# Altium schematic sheet BAT_Simulator.SchDoc
size A4; Organization: PERT; SheetNumber: 1; SheetTotal: 1; Sub Team: EEE
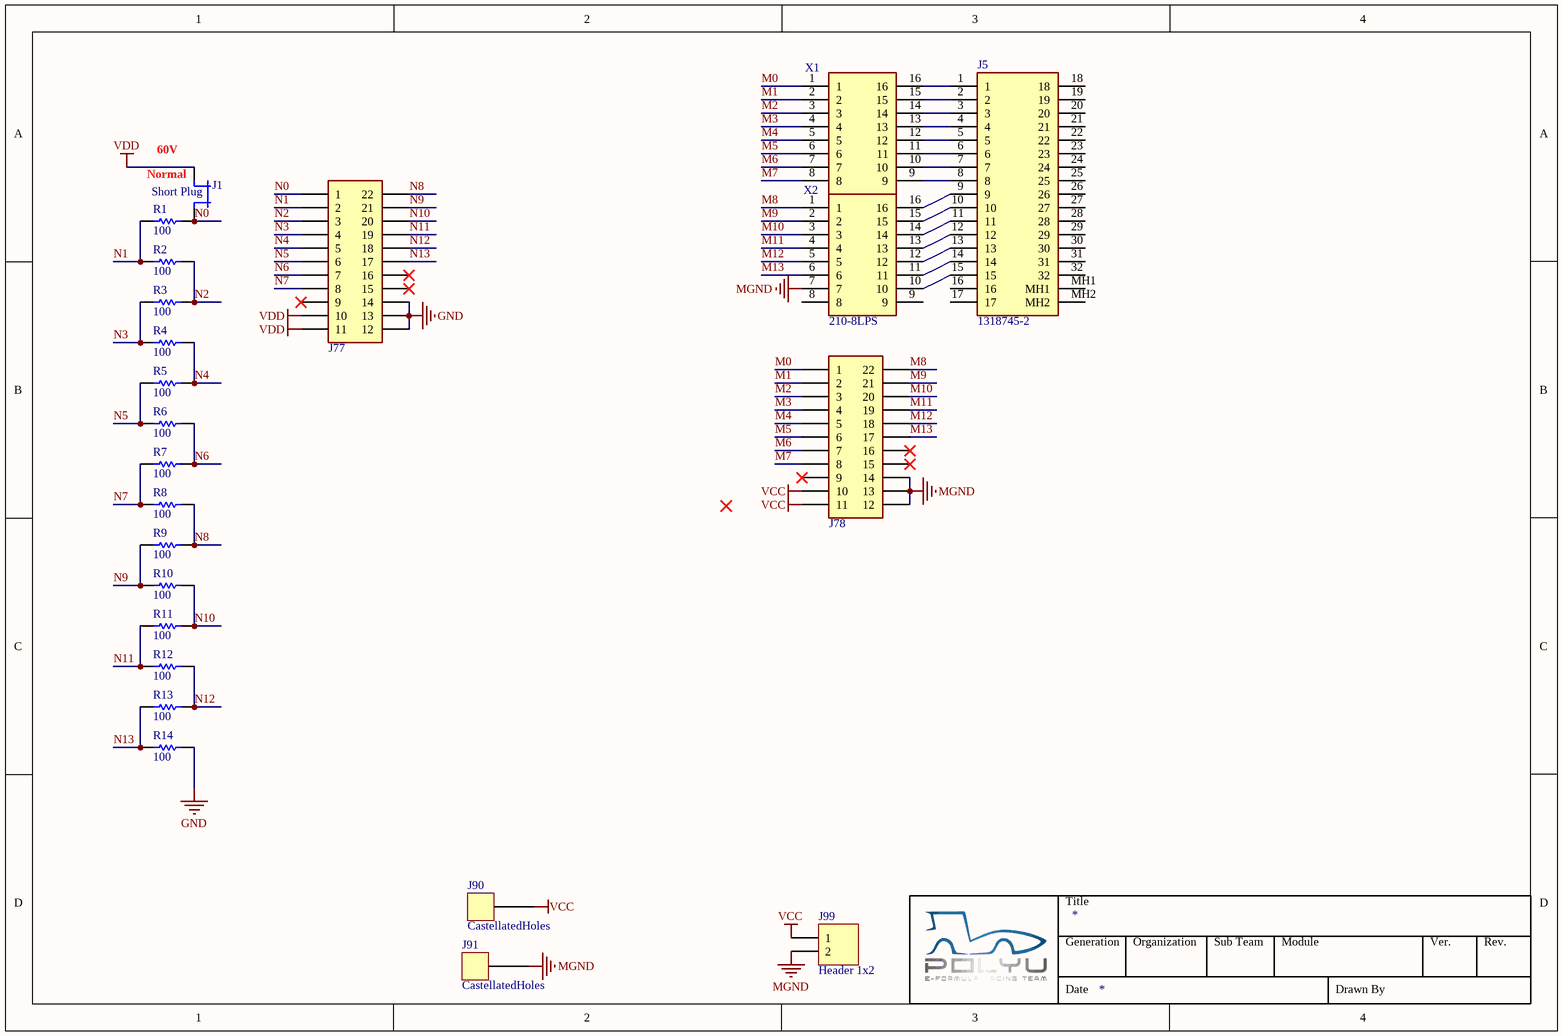
[diagram p0: BAT_Simulator.SchDoc]

## Parts
J1  Short Plug  [HDR_1X2_2.54_THD]
J5  1318745-2  [TH025_32P]
J77  Header 1x5  [HDR_2x11_2.54_THD]  (value not drawn)
J78  Header 1x5  [HDR_2x11_2.54_THD]  (value not drawn)
J90  CastellatedHoles  [CastellatedHole]  (no BOM)
J91  CastellatedHoles  [CastellatedHole]  (no BOM)
J99  Header 1x2  [HDR_1X2_2.54_THD]
R1  100  [2512_SMD_R]
R2  100  [2512_SMD_R]
R3  100  [2512_SMD_R]
R4  100  [2512_SMD_R]
R5  100  [2512_SMD_R]
R6  100  [2512_SMD_R]
R7  100  [2512_SMD_R]
R8  100  [2512_SMD_R]
R9  100  [2512_SMD_R]
R10  100  [2512_SMD_R]
R11  100  [2512_SMD_R]
R12  100  [2512_SMD_R]
R13  100  [2512_SMD_R]
R14  100  [2512_SMD_R]
X1  210-8LPS  [DIP Switch 8Ch]
X2  210-8LPS  [DIP Switch 8Ch]

## Nets
GND: J77.12 J77.13 J77.14 R14.2
MGND: J78.12 J78.13 J78.14 J91.1 J99.2 X2.7
VCC: J78.10 J78.11 J90.1 J99.1
VDD: J1.1 J77.10 J77.11
M0: J78.1 X1.1
M1: J78.2 X1.2
M2: J78.3 X1.3
M3: J78.4 X1.4
M4: J78.5 X1.5
M5: J78.6 X1.6
M6: J78.7 X1.7
M7: J78.8 X1.8
M8: J78.22 X2.1
M9: J78.21 X2.2
M10: J78.20 X2.3
M11: J78.19 X2.4
M12: J78.18 X2.5
M13: J78.17 X2.6
N0: J1.2 J77.1 R1.2
N1: J77.2 R1.1 R2.1
N2: J77.3 R2.2 R3.2
N3: J77.4 R3.1 R4.1
N4: J77.5 R4.2 R5.2
N5: J77.6 R5.1 R6.1
N6: J77.7 R6.2 R7.2
N7: J77.8 R7.1 R8.1
N8: J77.22 R8.2 R9.2
N9: J77.21 R9.1 R10.1
N10: J77.20 R10.2 R11.2
N11: J77.19 R11.1 R12.1
N12: J77.18 R12.2 R13.2
N13: J77.17 R13.1 R14.1
NetJ5_1: J5.1 X1.16
NetJ5_2: J5.2 X1.15
NetJ5_3: J5.3 X1.14
NetJ5_4: J5.4 X1.13
NetJ5_5: J5.5 X1.12
NetJ5_6: J5.6 X1.11
NetJ5_7: J5.7 X1.10
NetJ5_8: J5.8 X1.9
NetJ5_9: J5.9 X2.16
NetJ5_10: J5.10 X2.15
NetJ5_11: J5.11 X2.14
NetJ5_12: J5.12 X2.13
NetJ5_13: J5.13 X2.12
NetJ5_14: J5.14 X2.11
NetJ5_15: J5.15 X2.10

Not connected (* = marked no-connect by the designer): J5 16 17 18 19 20 21 22 23 24 25 26 27 28 29 30 31 32 MH1 MH2; J77 9* 15* 16*; J78 9* 15* 16*; X2 8 9

## Notes on the sheet
- (near J1) 60V
- (near J1) Normal
- Title
- Generation
- Organization
- Sub Team
- Module
- Ver.
- Rev.
- Date
- Drawn By

## Library data of the parts
J1 = Jumper: Jumper for shorting two net; Value: Short Plug
J5 = TE TH/.25 32P TH: TE CONNECTIVITY - 1318745-2 - Automotive Connector, TH 025 Series, Right Angle Plug, 32 Contacts, Crimp Pin; Geometry.Height: 15.5mm; Mouser Part Number: 571-1318745-2; Mouser Price/Stock: https://www.mouser.co.uk/ProductDetail/TE-Connectivity-AMP/1318745-2?qs=ajJfoEgdyuQ%2FBs4LKkUxbA%3D%3D; Manufacturer_Name: TE Connectivity; Manufacturer_Part_Number: 1318745-2; Datasheet Link: https://www.te.com/commerce/DocumentDelivery/DDEController?Action=showdoc&DocId=Customer+Drawing%7F1318745%7FB6%7Fpdf%7FJapanese%7FJPN_CD_1318745_B6.pdf%7F1318745-2
J77 J78 = Header 2x11: Geometry.Height: 10.745mm
J99 = Header 1x2: Header, 2-Pin
R1-R14 = 2512_SMD_Resistor: 2512 SMD Resistor; Tolerance: 1%; Power Rating: 3W; Temperature Coefficient: *; Value: 100
X1 X2 = DIP Switch 8Ch: DIP Switches / SIP Switches THROUGH HOLE, GOLD FLASH DIP SWITCH, 8-POLE, LOW PROFILE ACTUATOR, BOTTOM SEAL, TUBE PACK; Manufacturer_Name: CTS; Geometry.Height: 4.58mm; Mouser Part Number: *; Mouser Price/Stock: *; Manufacturer_Part_Number: 210-8LPS; Datasheet Link: https://datasheet.datasheetarchive.com/originals/dk/DKDS-29/575295.pdf